# Altium schematic sheet BBB_PCB.SchDoc
size A4
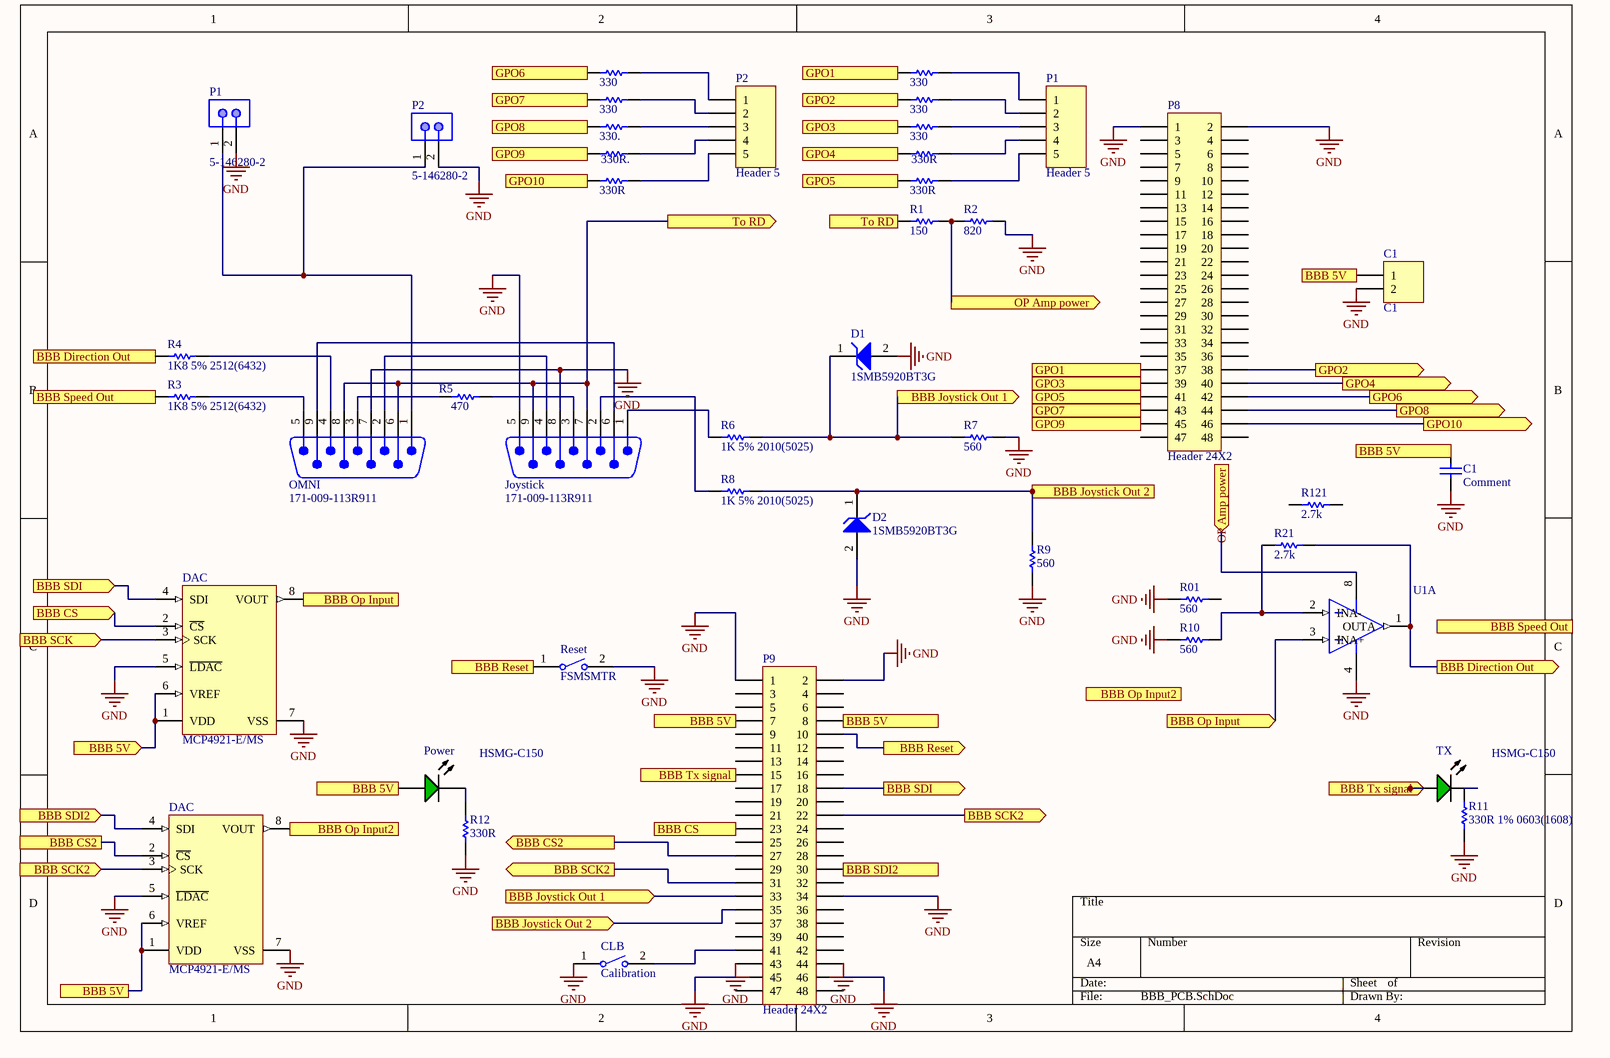
[diagram p0: BBB_PCB.SchDoc]

## Parts
(Parts that share a designator on the sheet are numbered #1, #2 ... from top to bottom, then left to right.)
?#1  330  [RESC0603(1608)_L]
?#2  330  [RESC0603(1608)_L]
?#3  330  [RESC0603(1608)_L]
?#4  330  [RESC0603(1608)_L]
?#5  330.  [RESC0603(1608)_L]
?#6  330  [RESC0603(1608)_L]
?#7  330R.  [RESC0603(1608)_L]
?#8  330R  [RESC0603(1608)_L]
?#9  330R  [RESC0603(1608)_L]
?#10  330R  [RESC0603(1608)_L]
C1#1  C1  [HDR1X2]
C1#2  Comment  [HDR1X2]
CLB  Calibration  [TECO-FSMSMTR_V]
D1  1SMB5920BT3G  [ONSC-SMB-2-403A-03_H_V]
D2  1SMB5920BT3G  [ONSC-SMB-2-403A-03_H_V]
DAC#1  MCP4921-E/MS  [MSOP-MS8_L]
DAC#2  MCP4921-E/MS  [MSOP-MS8_L]
Joystick  171-009-113R911  [NORCO-171-009-113R911_V]
OMNI  171-009-113R911  [NORCO-171-009-113R911_V]
P1#1  Header 5  [HDR1X5]
P1#2  5-146280-2  [TECO-5-146280-2_V]
P2#1  Header 5  [HDR1X5]
P2#2  5-146280-2  [TECO-5-146280-2_V]
P8  Header 24X2  [HDR2X24]
P9  Header 24X2  [HDR2X24]
Power  HSMG-C150  [AVAG-HSMX-C150_V]
R1  150  [RESC2013X60X40NL20T25]
R01  560  [RESC1005X40X25NL05T05]
R2  820  [RESC3225X60X45LL20T20]
R3  1K8 5% 2512(6432)  [RESC2512(6432)_N]
R4  1K8 5% 2512(6432)  [RESC2512(6432)_N]
R5  470  [RESC1005X40X25ML05T05]
R6  1K 5% 2010(5025)  [RESC2010(5025)_L]
R7  560  [RESC2512(6432)_M]
R8  1K 5% 2010(5025)  [RESC2010(5025)_L]
R9  560  [RESC2512(6432)_M]
R10  560  [RESC1005X40X25NL05T05]
R11  330R 1% 0603(1608)  [RESC0603(1608)_L]
R12  330R  [RESC0603(1608)_L]
R21  2.7k  [RESC1609X50X30ML10T20]
R121  2.7k  [RESC1609X50X30ML10T20]
Reset  FSMSMTR  [TECO-FSMSMTR_V]
TX  HSMG-C150  [AVAG-HSMX-C150_V]
U1  LM358AM  [D0008A_N]  (value not drawn)  (part A of 2)

## Ports
BBB 5V, BBB 5V (in), BBB 5V (out), BBB CS2, BBB CS2 (out), BBB CS (in), BBB CS (out), BBB Direction Out (in), BBB Direction Out (out), BBB Joystick Out 1 (in), BBB Joystick Out 1 (out), BBB Joystick Out 2 (in), BBB Joystick Out 2 (out), BBB Op Input2 (in), BBB Op Input2 (out), BBB Op Input (in), BBB Op Input (out), BBB Reset (in), BBB Reset (out), BBB SCK2 (in), BBB SCK2 (out), BBB SCK (in), BBB SDI2 (in), BBB SDI2 (out), BBB SDI (in), BBB SDI (out), BBB Speed Out (in), BBB Speed Out (out), BBB Tx signal (in), BBB Tx signal (out), GPO1 (in), GPO1 (out), GPO2 (in), GPO2 (out), GPO3 (in), GPO3 (out), GPO4 (in), GPO4 (out), GPO5 (in), GPO5 (out), GPO6 (in), GPO6 (out), GPO7 (in), GPO7 (out), GPO8 (in), GPO8 (out), GPO9 (in), GPO9 (out), GPO10 (in), GPO10 (out), OP Amp power (in), OP Amp power (out), To RD (in), To RD (out)

## Nets
GND: C1#1.2 C1#2.1 CLB.1 D1.2(A) D2.2(A) DAC#1.5(~{LDAC}) DAC#1.7(VSS) DAC#2.5(~{LDAC}) DAC#2.7(VSS) Joystick.5 Joystick.8 OMNI.7 P1#2.2 P2#2.2 P8.1 P8.2 P9.1 P9.2 P9.34 P9.43 P9.44 P9.45 P9.46 R01.1 R2.2 R7.2 R9.1 R10.1 R11.1 R12.1 Reset.2 U1.4(GND)
BBB 5V: C1#1.1 C1#2.2 DAC#1.1(VDD) DAC#1.6(VREF) DAC#2.1(VDD) DAC#2.6(VREF) P9.7 P9.8 Power.1(A) ; port BBB 5V
BBB CS: DAC#1.2(~{CS}) P9.23 ; port BBB CS
BBB CS2: DAC#2.2(~{CS}) P9.27 ; port BBB CS2
BBB Direction Out: R4.1 R21.2 U1.1(OUTA) ; port BBB Direction Out
BBB Joystick Out 1: D1.1(K) P9.33 R6.2 R7.1 ; port BBB Joystick Out 1
BBB Joystick Out 2: D2.1(K) P9.35 R8.2 R9.2 ; port BBB Joystick Out 2
BBB Op Input: DAC#1.8(VOUT) U1.3(INA+) ; port BBB Op Input
BBB Op Input2: DAC#2.8(VOUT) ; port BBB Op Input2
BBB Reset: P9.10 Reset.1 ; port BBB Reset
BBB SCK: DAC#1.3(SCK) ; port BBB SCK
BBB SCK2: DAC#2.3(SCK) P9.22 P9.31 ; port BBB SCK2
BBB SDI: DAC#1.4(SDI) P9.18 ; port BBB SDI
BBB SDI2: DAC#2.4(SDI) P9.30 ; port BBB SDI2
BBB Speed Out: R3.1 ; port BBB Speed Out
BBB Tx signal: P9.15 TX.1(A) ; port BBB Tx signal
GPO1: ?#2.1 P8.37 ; port GPO1
GPO2: ?#4.1 P8.38 ; port GPO2
GPO3: ?#6.1 P8.39 ; port GPO3
GPO4: ?#8.1 P8.40 ; port GPO4
GPO5: ?#10.1 P8.41 ; port GPO5
GPO6: ?#1.1 P8.42 ; port GPO6
GPO7: ?#3.1 P8.43 ; port GPO7
GPO8: ?#5.1 P8.44 ; port GPO8
GPO9: ?#7.1 P8.45 ; port GPO9
GPO10: ?#9.1 P8.46 ; port GPO10
OP Amp power: R1.2 R2.1 U1.8(V+) ; port OP Amp power
To RD: Joystick.7 Joystick.9 OMNI.6 OMNI.8 R1.1 ; port To RD
Net?#1_2: ?#1.2 P2#1.1
Net?#2_2: ?#2.2 P1#1.1
Net?#3_2: ?#3.2 P2#1.2
Net?#4_2: ?#4.2 P1#1.2
Net?#5_2: ?#5.2 P2#1.3
Net?#6_2: ?#6.2 P1#1.3
Net?#7_2: ?#7.2 P2#1.4
Net?#8_2: ?#8.2 P1#1.4
Net?#9_2: ?#9.2 P2#1.5
Net?#10_2: ?#10.2 P1#1.5
NetCLB_2: CLB.2 P9.41
NetJoystick_1: Joystick.1 R6.1
NetJoystick_2: Joystick.2 R8.1
NetJoystick_3: Joystick.3 R5.2
NetJoystick_4: Joystick.4 OMNI.2
NetJoystick_6: Joystick.6 OMNI.9
NetOMNI_1: OMNI.1 P1#2.1 P2#2.1
NetOMNI_3: OMNI.3 R5.1
NetOMNI_4: OMNI.4 R4.2
NetOMNI_5: OMNI.5 R3.2
NetPower_2: Power.2(K) R12.2
NetR10_2: R10.2 R21.1 U1.2(INA-)
NetR11_2: R11.2 TX.2(K)

Not connected (* = marked no-connect by the designer): P8 3 4 5 6 7 8 9 10 11 12 13 14 15 16 17 18 19 20 21 22 23 24 25 26 27 28 29 30 31 32 33 34 35 36 47 48; P9 3 4 5 6 9 11 12 13 14 16 17 19 20 21 24 25 26 28 29 32 36 37 38 39 40 42 47 48; R01 2; R121 1 2

## Library data of the parts
?#1-?#10 R11 R12 = CMP-1012-00454-1: 330R 0.1W 1% 0603 (1608 Metric)  SMD; Case-Metric: 1608; Value: 330.00 Ohm; Case-EIA: 0603; Tolerance: 1 %; Technology: SMT; Power: 0.1 W
C1#1 = Header 2: Header, 2-Pin; LatestRevisionDate: 17-Jul-2002; LatestRevisionNote: Re-released for DXP Platform.; Publisher: Altium Limited
C1#2 = CMP-2008-03080-1: Manufacturer: Kemet; Part Number: C0402C104J4RACTU
CLB Reset = CMP-2000-07501-1: FSMSM Push Button Switch, 50 mA, -35 to 85 degC, 2-Pin SMD, RoHS, Tape and Reel; Manufacturer: TE Connectivity; Voltage Rating (DC): 24V; Electrical Life: 20000Cycles; Operating Force: 180gf; Switch Travel: 0.25mm; Contact Current Rating: 50mA; Case\/Package: SMD/SMT; Actuator Length: 1.07mm; Throw Configuration: SPST; Actuator Material: Polyamide; Contact Resistance: 100mOhm; Illumination Type: Illuminated; Max Voltage Rating (DC): 12V; Manufacturer URL: http://www.te.com/; Lead Free: LeadFree; Packaging: TapeandReel; Min Operating Temperature: -35degC; Mechanical Life: 20000Cycles; Mount: SurfaceMount; REACH SVHC: Unknown; Package Quantity: 1800; Package Reference: FSMSMTR; RoHSCompliant: true; Max Operating Temperature: 85degC; Orientation: Straight; ELV: Compliant; Datasheet URL: http://www.te.com/commerce/DocumentDelivery/DDEController?Action=showdoc&DocId=Customer+Drawing%7F1437566-3%7FC2%7Fpdf%7FEnglish%7FENG_CD_1437566-3_C2_1437566_3_1_c.dwg.pdf%7F1437566-4; Package Description: 2-Pin Surface Mount Device, Body 6 x 3.5 mm, Pitch 9.19 mm; Current Rating: 50mA; Contact Plating: Silver; Termination: GullWing; Datasheet Version: Rev. C2, 08/2014; Contact Material: Brass; Mounting Technology: SurfaceMount
D1 D2 = CMP-1060-00222-1: 3 W Zener Voltage Regulator, 2-Pin SMB, Pb-Free, Tape and Reel; Manufacturer: On Semiconductor; VZ Typ (V): 6.2; Packing: Tape and Reel; PackageDescription: 2-Pin Small Molded Package, J-Bend Lead, Body 4.33 x 3.625 mm; Mounting Technology: Surface Mount; PackageVersion: Rev. H, 05/2011; ComponentLink1Description: Manufacturer URL; RoHS: Pb-Free; DatasheetVersion: Rev. 8; ComponentLink2Description: Datasheet; PartNumber: 1SMB5920BT3G; ComponentLink2URL: http://www.onsemi.com/pub_link/Collateral/1SMB5913BT3-D.PDF; ComponentLink1URL: http://www.onsemi.com/; ComponentLink3Description: Package Specification; PackageReference: SMB-2-403A-03_H; ComponentLink3URL: http://www.onsemi.com/pub_link/Collateral/1SMB5913BT3-D.PDF
DAC#1 DAC#2 = CMP-0188-00937-2: 12-Bit DAC with SPI Interface, 8-Pin MSOP, Extended Temperature; ComponentLink1URL: http://www.microchip.com/; PackageVersion: revBB, Aug-2009; ComponentLink3Description: Package Specification; PackageDescription: 8-Lead Plastic Micro Small Outline Package (MS) [MSOP]; ComponentLink2Description: Datasheet; DatasheetVersion: revA, Apr-2010; ComponentLink2URL: http://ww1.microchip.com/downloads/en/DeviceDoc/22248a.pdf; ComponentLink1Description: Manufacturer URL; PackageReference: MSOP-MS8; RevisionNote: URLs added. DatasheetVersion updated. Sch updated.; ComponentLink3URL: http://www.microchip.com/stellent/groups/techpub_sg/documents/packagingspec/en012702.pdf
Joystick OMNI = CMP-2000-05495-1: Male Header, Pitch 2.77 mm, 2 Row, 9 Position, Height 12.52 mm, Tail Length 4.8 mm, -55 to 100 degC, RoHS, Tray; Manufacturer: Norcomp; Other Names: 171009113R9119209ME; Mating Products: 4209FE-ND-CONND-SUBRCPT9POSVERTSOLDER709FE-ND-CONNDB9CRIMPFEMALENICKEL709FER-ND-CONNDB9CRIMPFEMALETIN186-009-292L001-ND-CONNDSUBRCPT9POSSTRIDC186-009-292L551-ND-CONNDSUBRCPT9POSSTRIDC209F-ND-CONNDSUBRCPT9POSSTRSLDRCUP709F-ND-CONNDB9CRIMPFEMALETIN1709F-ND-CONNDB9CRIMPFEMYLWCHROME4209F-ND-CONND-SUBRCPT9POSVERTSOLDER1709FA-ND-CONNDB9CRIMPFEMYLWCHROME209FEA-ND-CONNDSUBRCPT9POSSTRSLDRCUP; Number of Positions: 9; Catalog Drawings: Footprint9,15,25-,37Position171,172SeriesDipSolder; Other Related Documents: 171-009-113R911MaterialDeclaration; Online Catalog: 171Series; Flange Feature: MatingSide,FemaleScrewlock(4-40); Product Training Modules: D-SubConnectors; Connector Style: D-Sub; Current Rating: 5A; Connector Type: Plug,MalePins; Associated Product: 160-09MA-ND-DUSTCOVERFORDB9MALE; 3D Model: 171-009-113Rzzz.pdf171-009-113Rzzz.stp171-009-113Rzzz.igs; Voltage Rating: -; Packaging: Tray; Operating Temperature: -50°C~100°C; Number of Rows: 2; Datasheet URL: http://www.norcomp.net/rohspdfs/Connectors/17Y/171/171-YYY-113RYY1.pdf; Housing Material: Polyamide(PA9T),Nylon9T; Color: Black; Series: 171; Mounting Technology: ThroughHole; Ingress Protection: -; Features: BoardLock,GroundingIndents; Family: D-SubConnectors; Category: Connectors,Interconnects; Termination: Solder; Shell Material, Finish: Steel,NickelPlated; Standard Package: 80; Package Description: Male Header, Pitch 2.77 mm, 2 Row, 9 Position, Height 12.52 mm, Tail Length 4.8 mm; Manufacturer URL: http://www.norcomp.net/; Mounting Type: ThroughHole; Datasheet Version: Rev. 11, 09/2015; Package Reference: 171-009-113R911; Contact Finish: Gold; Shell Size, Connector Layout: 1(DE,E); Contact Type: Signal; Contact Finish Thickness: Flash
P1#1 P2#1 = Header 5: Header, 5-Pin; LatestRevisionDate: 17-Jul-2002; LatestRevisionNote: Re-released for DXP Platform.; Publisher: Altium Limited
P1#2 P2#2 = CMP-2000-07492-1: Male Header, Pitch 2.54 mm, 1 x 2 Position, Height 8.21 mm, Tail Length 3.05 mm, -65 to 105 degC, RoHS, Bulk; Manufacturer: TE Connectivity; Mating Connector Lock: No(Without); Number of Positions: 2; Pitch: 2.54mm; PCB Mounting Orientation: Vertical; Keyed: No; Case\/Package: 100; Mating Post Length: 0.23inch; High Temperature Housing: Yes; Max Current Rating: 5A; PCB Thickness: 0.063inch; PCB Mount Retention: Without; Approvals: CSA; Current Rating: 3A; Radiation Hardening: No; Length: 4.67mm; Contact Mating Length: 0.23inch; Connector Type: Header; Number of Rows: 1; Termination Post Length: 0.12inch; Board Standoff: No(Without); Max Operating Temperature: 105degC; Contact Shape: Square; Selectively Loaded: No(Without); Gasket: No(Without); Number of Contacts: 2; Contact Gender: Male; Mating Alignment: No(Without); Manufacturer URL: http://www.te.com/; Datasheet URL: http://www.te.com/commerce/DocumentDelivery/DDEController?Action=showdoc&DocId=Customer+Drawing%7F146280%7FH1%7Fpdf%7FEnglish%7FENG_CD_146280_H1.pdf%7F5-146280-2; Mount: ThroughHole; Orientation: Straight; Packaging: Carton; Package Reference: 5-146280-2; Package Quantity: 500; Stabilizers: No(Without); Row Spacing: 2.54mm; Contact Material: CopperAlloy; Panel Mount Retention: No(Without); Datasheet Version: Rev. H1, 08/2016; Housing Colour: Black; Colour: Black; Package Description: Male Header, Pitch 2.54 mm, 1 x 2 Position, Height 8.21 mm, Tail Length 3.05 mm; Contact Plating: Matte; Housing Material: Polymer; Contact Protection: No(Without); Min Operating Temperature: -65degC; Mounting Technology: ThroughHole; Flammability Rating: UL94V-0; RoHSCompliant: true; Termination: ThroughHole; Depth: 2.34mm; High Speed Serial Data Connector: No
P8 P9 = Header 24X2: Header, 24-Pin, Dual row; LatestRevisionDate: 17-Jul-2002; LatestRevisionNote: Re-released for DXP Platform.; Publisher: Altium Limited
Power TX = CMP-2000-05061-1: Chip LED, Green, 65 mW, 25 mA, -40 to 85 degC, 2-Pin SMD, RoHS, Tape and Reel; Manufacturer: Avago; Forward Voltage VF Max: 2.6V; Forward Current If Max: 20mA; Bulb Size: 1.6mmx2mm; PIV Max: 5V; Dominant Wavelength: 572nm; External Length / Height: 3.2mm; SVHC: NoSVHC(16-Jun-2014); Viewing Angle: 170deg; Peak Wavelength: 570nm; External Width: 1.6mm; No. of Pins: 2; Luminous Intensity Typ: 15mcd; Light Output Orientation: TopEmitting; LED Type: Standard; Luminous Intensity @ If Min: 4.5mcd; Voltage Vf Min: 2.2V; Lens Shape: Rectangular; External Depth: 1.1mm; Opto Mounting Orientation: Top; Package Reference: HSMX-C150; Mounting Type: SMD; Datasheet Version: Mar-12; Storage Temperature Max: 85degC; Forward Current If: 20mA; Operating Temperature Min: -30degC; Operating Temperature Max: 85degC; Wavelength Typ: 572nm; Datasheet URL: https://datasheet.ciiva.com/11774/0900766b804a6539-11774272.pdf; Luminous Intensity: 15mcd; Manufacturer URL: http://www.avagotech.com/; Storage Temperature Min: -40degC; Package Description: 2-Pin Surface Mount Device, Body 3.2 x 1.6 mm; MSL: MSL2A-4weeks; LED Colour: Green; Operating Temperature Range: -30degCto+85degC; LED Mounting: SMD; Voltage Vf Typ: 2.2V; Opto Case Style: SMD; Packaging: CutTape; Material: GaP; Forward Voltage: 2.2V; Reverse Protection Voltage: 5V
R1 = CMP-2001-00596-1: Manufacturer: Panasonic; Part Number: ERA6AEB151V
R01 R10 = CMP-2002-00097-1: Part Number: CRCW0402560RFKED; Manufacturer: Vishay Dale
R2 = CMP-2005-00227-1: Manufacturer: Vishay Dale; Part Number: CRCW1210820RJNEAHP
R3 R4 = CMP-1018-00080-1: 1K8 1W 5% 2512 (6432 Metric)  SMD; Value: 1800.00 Ohm; Case-Metric: 6432; Case-EIA: 2512; Technology: SMT; Power: 1 W; Tolerance: 5 %
R5 = CMP-2002-01153-1: Manufacturer: Panasonic; Part Number: ERJ2RKF4700X
R6 R8 = CMP-1017-00074-1: 1K 0.75W 5% 2010 (5025 Metric)  SMD; Case-EIA: 2010; Value: 1000.00 Ohm; Case-Metric: 5025; Technology: SMT; Tolerance: 5 %; Power: 0.75 W
R7 R9 = CMP-1018-00068-1: 560R 1W 5% 2512 (6432 Metric)  SMD; Case-EIA: 2512; Case-Metric: 6432; Value: 560.00 Ohm; Tolerance: 5 %; Power: 1 W; Technology: SMT
R21 R121 = CMP-2000-03182-1: Part Number: CRCW06032K70FKEA; Manufacturer: Vishay Dale
U1 = CMP-0055-00796-3: Low Power Dual Operational Amplifier, 8-pin Narrow SOIC; Manufacturer: Texas Instruments; CompType: Amplifiers; PackageTopMarking: NSZXTT*LM*358AM; PowerWise: N; Code_JEDEC: MS-012-AA; RoHS: N; PinCount: 8; Package Reference: D0008A; ComponentLink1Description: Datasheet URL; ComponentLink1URL: http://www.ti.com/general/docs/lit/getliterature.tsp?genericPartNumber=LM358-N&fileType=pdf; Code_IPC: SOIC127P600-8; PackageDescription: SOIC Narrow, 4.9 x 3.9 x 1.45mm, 8 Lead, 1.27mm Pitch